# EAGLE design Switch-N-Sense (EAGLE 7.7.0)
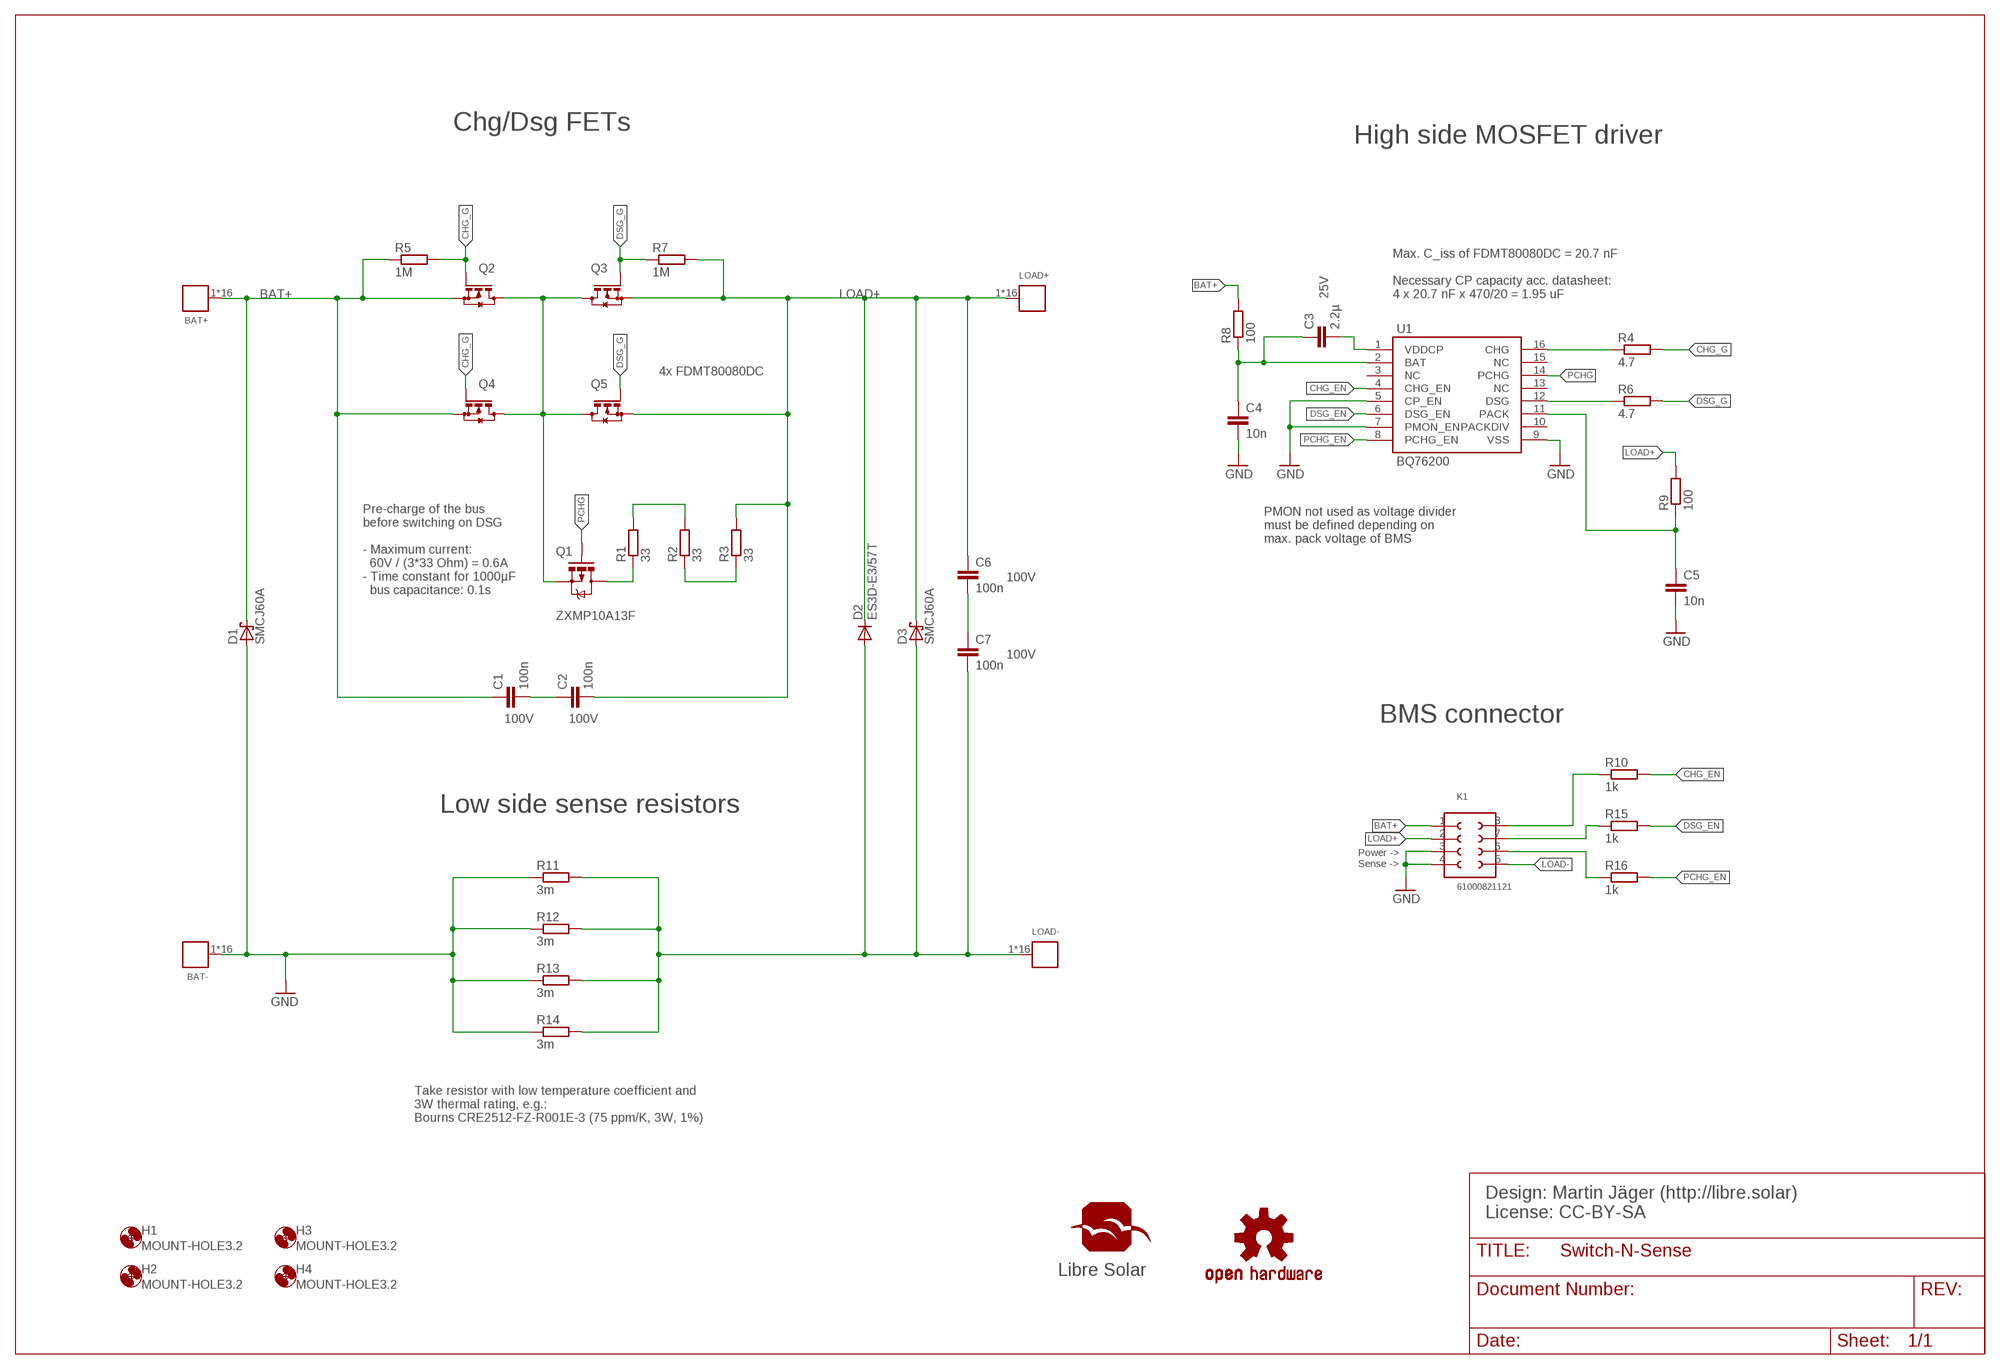
[diagram p0: schematic, sheet 1]

## Parts
BAT+  WP-BUCF_G  [16PINS_CIR]
BAT-  WP-BUCF_G  [16PINS_CIR]
C1  100n  C-EUC0603  [C0603]
C2  100n  C-EUC0603  [C0603]
C3  2.2µ  C-EUC0805  [C0805]
C4  10n  C-EUC0603  [C0603]
C5  10n  C-EUC0603  [C0603]
C6  100n  C-EUC0603  [C0603]
C7  100n  C-EUC0603  [C0603]
D1  SMCJ60A  SCHOTTKY-DIODESMC  [SMC]
D2  ES3D-E3/57T  DIODE-SMC  [SMC]
D3  SMCJ60A  SCHOTTKY-DIODESMC  [SMC]
H1  MOUNT-HOLE3.2  [3,2]
H2  MOUNT-HOLE3.2  [3,2]
H3  MOUNT-HOLE3.2  [3,2]
H4  MOUNT-HOLE3.2  [3,2]
K1  61000821121  [61000821121]
LOAD+  WP-BUCF_G  [16PINS_CIR]
LOAD-  WP-BUCF_G  [16PINS_CIR]
N1  OSHW-LOGOM  [OSHW-LOGO-M]
Q1  ZXMP10A13F  MOSFET-PCHANNEL  [SOT23-3]
Q2  FDMT80080DC  [FDMT80080DC]
Q3  FDMT80080DC  [FDMT80080DC]
Q4  FDMT80080DC  [FDMT80080DC]
Q5  FDMT80080DC  [FDMT80080DC]
R1  33  R-EU_R2010  [R2010]
R2  33  R-EU_R2010  [R2010]
R3  33  R-EU_R2010  [R2010]
R4  4.7  R-EU_R0603  [R0603]
R5  1M  R-EU_R0603  [R0603]
R6  4.7  R-EU_R0603  [R0603]
R7  1M  R-EU_R0603  [R0603]
R8  100  R-EU_R0603  [R0603]
R9  100  R-EU_R0603  [R0603]
R10  1k  R-EU_R0603  [R0603]
R11  3m  R-EU_R2512  [R2512]
R12  3m  R-EU_R2512  [R2512]
R13  3m  R-EU_R2512  [R2512]
R14  3m  R-EU_R2512  [R2512]
R15  1k  R-EU_R0603  [R0603]
R16  1k  R-EU_R0603  [R0603]
U1  BQ76200  [TSSOP16]
U$1  LIBRESOLAR_LOGO  [LIBRESOLAR_LOGO]

## Nets
BAT+: BAT+.1 BAT+.2 BAT+.3 BAT+.4 BAT+.5 BAT+.6 BAT+.7 BAT+.8 BAT+.9 BAT+.10 BAT+.11 BAT+.12 BAT+.13 BAT+.14 BAT+.15 BAT+.16 C1.1 D1.C K1.1 Q2.S Q4.S R5.1 R8.2
CHG: R4.1 U1.16(CHG)
CHG_EN: R10.2 U1.4(CHG_EN)
CHG_G: Q2.G Q4.G R4.2 R5.2
CHGDSG [power]: Q1.2(S) Q2.D Q3.D Q4.D Q5.D
DSG: R6.1 U1.12(DSG)
DSG_EN: R15.2 U1.6(DSG_EN)
DSG_G: Q3.G Q5.G R6.2 R7.1
GND [power]: BAT-.1 BAT-.2 BAT-.3 BAT-.4 BAT-.5 BAT-.6 BAT-.7 BAT-.8 BAT-.9 BAT-.10 BAT-.11 BAT-.12 BAT-.13 BAT-.14 BAT-.15 BAT-.16 C4.2 C5.2 D1.A K1.3 K1.4 R11.1 R12.1 R13.1 R14.1 U1.5(CP_EN) U1.7(PMON_EN) U1.9(VSS)
LOAD+ [power]: C2.2 C6.1 D2.C D3.C K1.2 LOAD+.1 LOAD+.2 LOAD+.3 LOAD+.4 LOAD+.5 LOAD+.6 LOAD+.7 LOAD+.8 LOAD+.9 LOAD+.10 LOAD+.11 LOAD+.12 LOAD+.13 LOAD+.14 LOAD+.15 LOAD+.16 Q3.S Q5.S R3.2 R7.2 R9.2
LOAD-: C7.2 D2.A D3.A K1.5 LOAD-.1 LOAD-.2 LOAD-.3 LOAD-.4 LOAD-.5 LOAD-.6 LOAD-.7 LOAD-.8 LOAD-.9 LOAD-.10 LOAD-.11 LOAD-.12 LOAD-.13 LOAD-.14 LOAD-.15 LOAD-.16 R11.2 R12.2 R13.2 R14.2
N$1: C6.2 C7.1
N$2: R1.2 R2.2
N$3: R2.1 R3.1
N$4: K1.7 R15.1
N$5: K1.6 R16.1
N$6: K1.8 R10.1
N$38: C3.2 U1.1(VDDCP)
N$40: C3.1 C4.1 R8.1 U1.2(BAT)
N$41: C5.1 R9.1 U1.11(PACK)
N$48: C1.2 C2.1
N$52: Q1.3(D) R1.1
PCHG: Q1.1(G) U1.14(PCHG)
PCHG_EN: R16.2 U1.8(PCHG_EN)
Unconnected: U1.3(NC) U1.10(PACKDIV) U1.13(NC) U1.15(NC)

## Notes on the sheet
- Chg/Dsg FETs
- High side MOSFET driver
- 25V
- Max. C_iss of FDMT80080DC = 20.7 nF
  
  Necessary CP capacity acc. datasheet:
  4 x 20.7 nF x 470/20 = 1.95 uF
- 4x FDMT80080DC
- PMON not used as voltage divider
  must be defined depending on
  max. pack voltage of BMS
- 100V
- Pre-charge of the bus
  before switching on DSG
  
  - Maximum current:
    60V / (3*33 Ohm) = 0.6A
  - Time constant for 1000µF
    bus capacitance: 0.1s
- 100V
- 100V | 100V | BMS connector
- Low side sense resistors
- Power ->
  Sense ->
- Take resistor with low temperature coefficient and 
  3W thermal rating, e.g.:
  Bourns CRE2512-FZ-R001E-3 (75 ppm/K, 3W, 1%)
- Design: Martin Jäger (http://libre.solar)
  License: CC-BY-SA

## Library data of the parts
BAT+ BAT- LOAD+ LOAD- = Wuerth_Elektronik_Power_Elements_rev15c:WP-BUCF: Bush with Pin-Plate Circumferences Characteristics Drill hole diameter:1.60(-0.03)mm Final hole diameter for HAL surface:1.45(+/-0.05)mm forchemical tin:1.475(+/-0.05)mm Min. layer thickness of copper in the via:25UM Max.layer thickness of tin in the via:15UM MATERIAL:CuZn39Pb3 Variant abbreviation CIR means Bush with Pin-Plate Circumferences F,G,H,E means Format Type HAL means Land pattern for HAL <http://katalog.we-online.de/media/images/v2/Family_WP-BUCF.jpg> Details see: http://katalog.we-online.de/en/em/Powerbuchsen_rundumlaufend/7461148?m 2015 (C) Wurth Elektronik
C1-C3 C6 C7 = rcl:C-EU: CAPACITOR, European symbol; MF: WALSIN; MPN: 0603B104K500CT; OC_FARNELL: 2496834
C4 C5 = rcl:C-EU: CAPACITOR, European symbol; MF: MURATA; MPN: GRM188R71H103KA01D.; OC_FARNELL: 8819980
D1 D3 = diode:SCHOTTKY-DIODE: Schottky Diode; MF: FAIRCHILD SEMICONDUCTOR; MPN: SMCJ75A; OC_FARNELL: 2322496
D2 = diode:DIODE-: DIODE; MF: VISHAY; MPN: ES3D-E3/57T.; OC_FARNELL: 1021753
H1-H4 = holes:MOUNT-HOLE: MOUNTING HOLE with drill center marker; OC_FARNELL: unknown
K1 = Board_to_Board_Connectors_rev15d:61000821121: WR-PHD 2.54mm Dual SMT Pin Header, 8 Pins =>Code : Con_BTB_PHD_2.54_2_61000821121 <http://katalog.we-online.de/media/images/eican/Con_BTB_PHD_2.54_2_6100xx21121_pf2.jpg> Details see: http://katalog.we-online.de/en/em/610_0xx_211_21 Created 2014-05-29, Karrer Zheng 2014 (C) Würth Elektronik
N1 = resolut:OSHW-LOGO: Open Source Hardware Logo This logo indicates the piece of hardware it is found on incorporates a OSHW license and/or adheres to the definition of open source hardware found here: http://freedomdefined.org/OSHW; OC_FARNELL: unknown
Q1 = SparkFun-DiscreteSemi:MOSFET-PCHANNEL: Generic PMOSFET IRLML2244 - TRANS-11153 (SOT-23 -20V -4.3A) (1.Gate 2.Source 3.Drain) FQP27P06 - COM-10349 <http://www.sparkfun.com/products/10349> (TO-220 -60V -27A) (1.Gate 2.Source 3.Drain); MF: DIODES INC.; MPN: ZXMP10A13FTA; OC_FARNELL: 1843777; PROD_ID: TRANS-08285
Q2-Q5 = resolut:FDMT80080DC; OC_FARNELL: unknown
R1-R3 = rcl:R-EU_: RESISTOR, European symbol; MF: WELWYN; MPN: ASC2010-33RFT4; OC_FARNELL: 2079038
R4-R7 R10 R15 R16 = rcl:R-EU_: RESISTOR, European symbol; MF: PANASONIC ELECTRONIC COMPONENTS; MPN: ERJU06F1004V; OC_FARNELL: 2145441
R8 R9 = rcl:R-EU_: RESISTOR, European symbol; MF: MULTICOMP; MPN: MCMR06X1001FTL; OC_FARNELL: 2073348
R11-R14 = rcl:R-EU_: RESISTOR, European symbol; OC_FARNELL: unknown
U1 = resolut:BQ76200; OC_FARNELL: unknown
U$1 = LibreSolar:LIBRESOLAR_LOGO

## Net classes
0 default: width 0.203 mm, drill 0.5 mm, clearance 0.152 mm
1 power: width 0.203 mm, drill 0.5 mm, clearance 0.152 mm
2 VIN: width 0.203 mm, drill 0.5 mm, clearance 0.152 mm

## Board
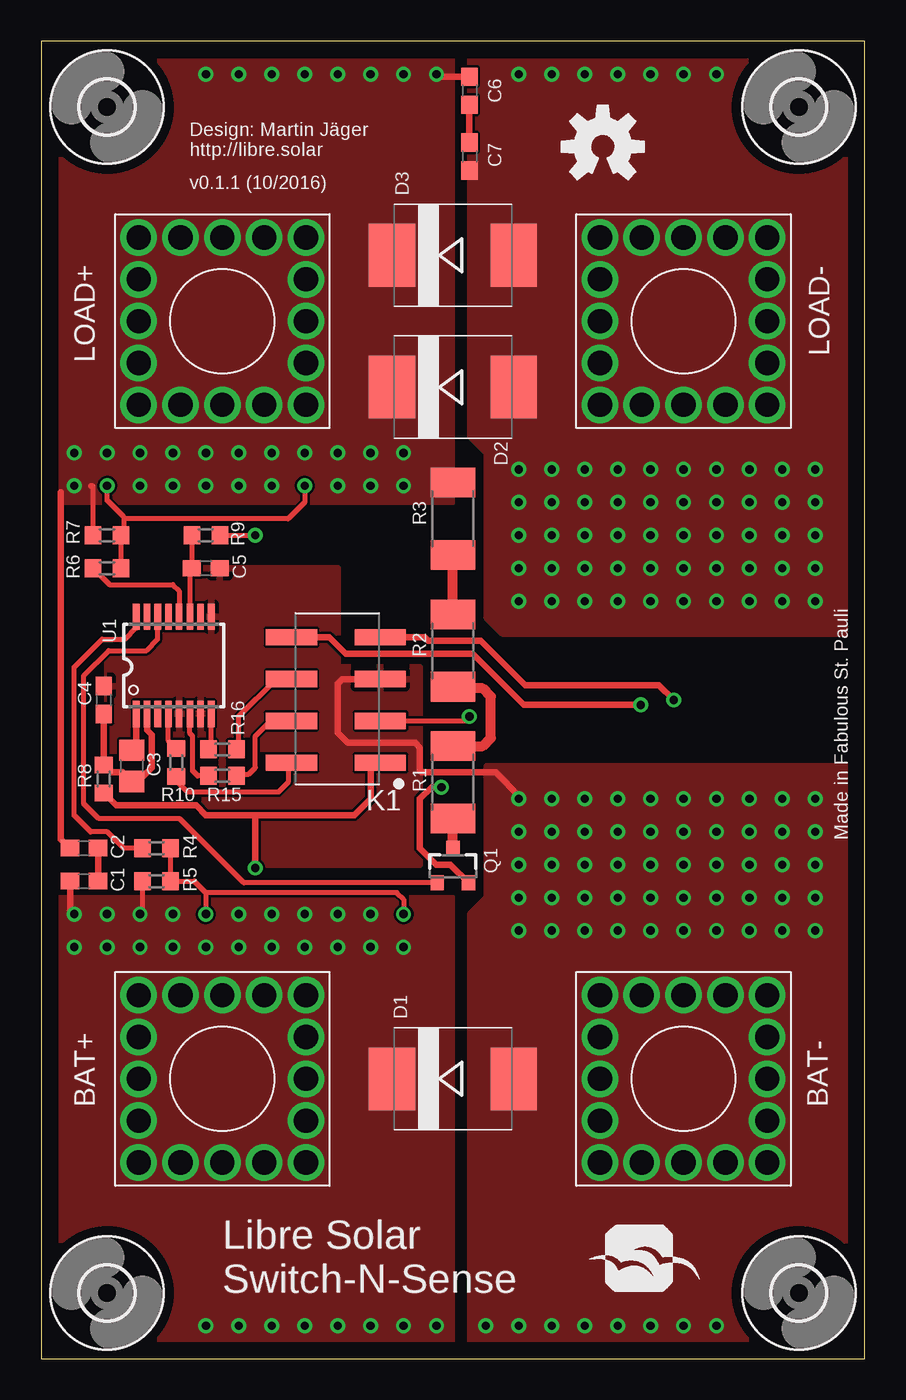
[diagram p1: board, top side]
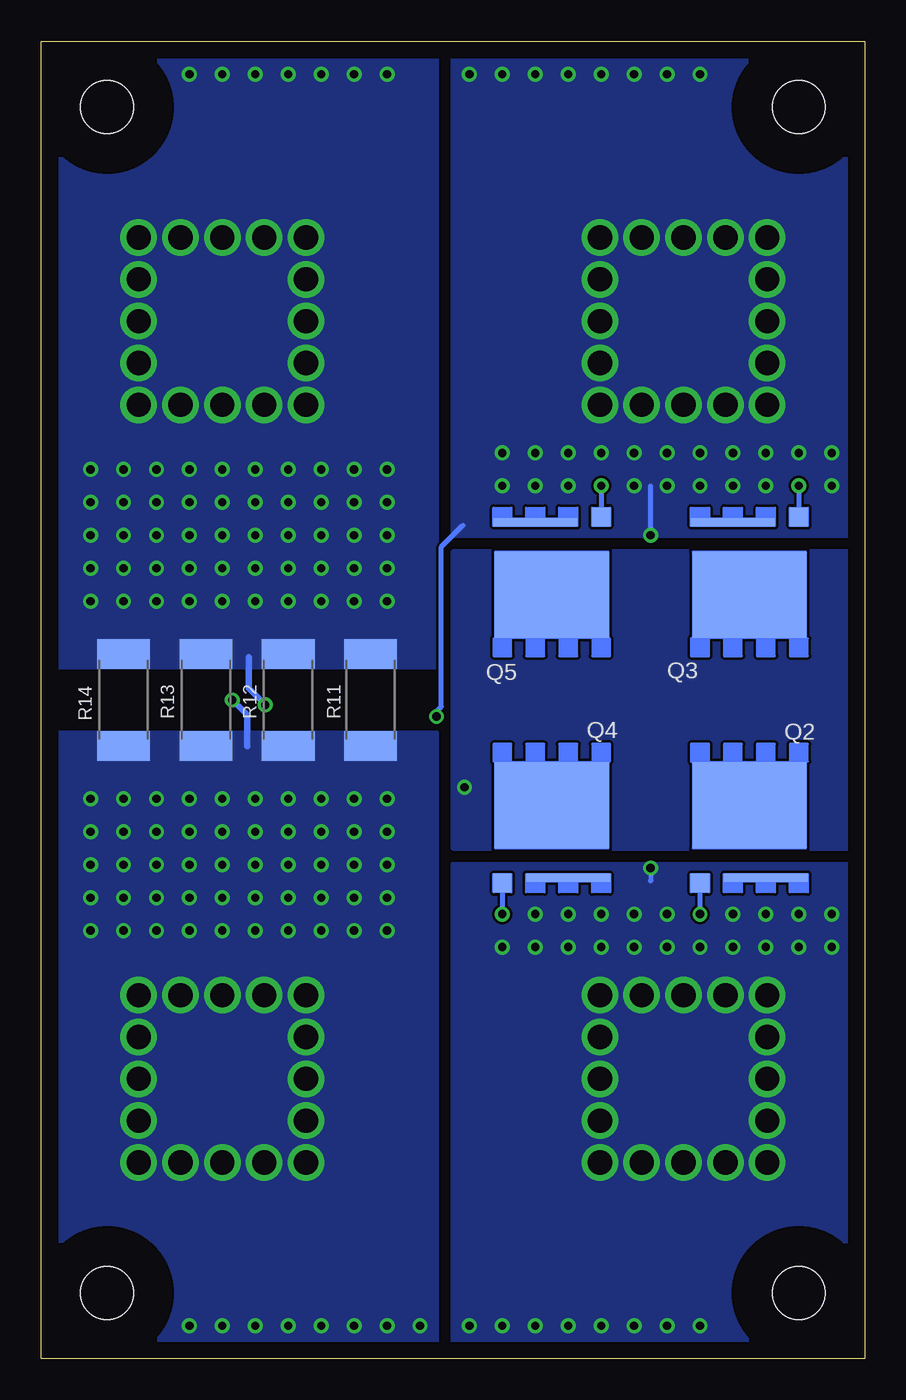
[diagram p2: board, bottom side, seen from below]

Size 50 x 80 mm. Coordinates in mm from the lower left corner, seen from the top.
Outline: 50,0 50,80 0,80 0,0 50,0
Copper layers (1*16): Top 0.035mm / dielectric 1.5mm / Bottom 0.035mm
Design rules "default *": minimum track width 6mil, minimum drill 0.3mm, track to track 6mil, track to pad 6mil, pad to pad 6mil, via to via 6mil, smd to smd 6mil, copper to edge 40mil, drill to drill 8mil, minimum pad ring 10mil, minimum via ring 8mil, stop-mask expansion 4mil, vias tented up to drill 0mil, thermal gap 10mil

### Footprints (pad centres in the part's own frame; a part is rotated, then mirrored left to right if it is on the bottom)
16PINS_CIR = drill 1.475: 1 -5.08,5.08; 2 -2.54,5.08; 3 0,5.08; 4 2.54,5.08; 5 5.08,5.08; 6 5.08,2.54; 7 5.08,0; 8 5.08,-2.54; 9 5.08,-5.08; 10 2.54,-5.08; 11 0,-5.08; 12 -2.54,-5.08; 13 -5.08,-5.08; 14 -5.08,-2.54; 15 -5.08,0; 16 -5.08,2.54
C0603 = smd 1.1 x 1: 1 -0.85,0; 2 0.85,0
C0805 = smd 1.3 x 1.5: 1 -0.95,0; 2 0.95,0
SMC = smd 2.8 x 3.8: A 3.7,0; C -3.7,0
3,2 = hole 3.2: 0,0
61000821121 = smd 1 x 3.1: 1 -6.35,-2.7; 2 -3.81,-2.7; 3 -1.27,-2.7; 4 1.27,-2.7; 5 1.27,2.7; 6 -1.27,2.7; 7 -3.81,2.7; 8 -6.35,2.7
SOT23-3 = smd 0.8 x 0.9: 1 -0.95,-1; 2 0.95,-1; 3 0,1.1
FDMT80080DC = smd 6.9 x 5.23: D 0,2.615 | smd 1.1 x 1.13: G -3,-2.115 | smd 5.1 x 0.48: S 1,-1.8
R2010 = smd 1.8 x 2.7: 1 -2.2,0; 2 2.2,0
R0603 = smd 1 x 1.1: 1 -0.85,0; 2 0.85,0
R2512 = smd 1.8 x 3.2: 1 -2.8,0; 2 2.8,0
TSSOP16 = smd 0.4 x 1.6: 1 -2.225,-2.85; 2 -1.575,-2.85; 3 -0.925,-2.85; 4 -0.275,-2.85; 5 0.375,-2.85; 6 1.025,-2.85; 7 1.675,-2.85; 8 2.325,-2.85; 9 2.325,3.05; 10 1.675,3.05; 11 1.025,3.05; 12 0.375,3.05; 13 -0.275,3.05; 14 -0.925,3.05; 15 -1.575,3.05; 16 -2.225,3.05

### Placement (x,y rotation side)
BAT+  11,17 90 top
BAT-  39,17 90 top
C1  2.6,29 0 top
C2  2.6,31 180 top
C3  5.5,36 90 top
C4  3.8,40 90 top
C5  10,48 0 top
C6  26,77 270 top
C7  26,73 270 top
D1  25,17 0 top
D2  25,59 0 top
D3  25,67 0 top
H1  4,4 90 top
H2  46,4 90 top
H3  4,76 90 top
H4  46,76 90 top
K1  17.9,42.54 90 top
LOAD+  11,63 90 top
LOAD-  39,63 90 top
N1  34.1,73.6 0 top
Q1  25,29.9 0 top
Q2  7,31 0 bottom
Q3  7,49 180 bottom
Q4  19,31 0 bottom
Q5  19,49 180 bottom
R1  25,35 90 top
R2  25,43 270 top
R3  25,51 90 top
R4  7,31 0 top
R5  7,29 0 top
R6  4,48 0 top
R7  4,50 180 top
R8  3.8,35.2 270 top
R9  10,50 0 top
R10  8.2,36.2 90 top
R11  30,40 90 bottom
R12  35,40 90 bottom
R13  40,40 90 bottom
R14  45,40 90 bottom
R15  11,35.4 180 top
R16  11,37 180 top
U1  8,42 0 top
U$1  34.3,4.1 0 top

### Tracks (layer width: path | path; a pad name or v marks a point on that pad's centre or on a via)
BAT+  (via drill 0.5)
  Top 0.305: R5.1 6.15,27
  Top 0.406: 13,33 v13,29.8 | 13,33 10,33 9.4,33.6 4.55,33.6 R8.2 | C1.1 1.75,27.25 v2,27 | 13,33 19,33 20,34 20,36 20.41,36 K1.1
  Bottom 0.305: v13,29.8 13,29
  other vias: 24,2 22,2 20,2 18,2 16,2 12,2 10,2 14,2 4,27 6,27 8,27 20,27 18,27 16,27 14,27 12,27 2,25 4,25 6,25 8,25 10,25 12,25 14,25 16,25 18,25 20,25 22,25
  pour Bottom (no thermals): 1,1 1,30 25,30 25,1
  pour Top (no thermals): 1,1 25,1 25,28 1,28
CHG
  Top 0.305: R4.1 5,31 4,32 3,32 2,33 2,42 3.7,43.7 5.1,43.7 5.78,44.38 U1.16
CHG_EN
  Top 0.305: R10.2 7.72,37.52 U1.4
CHG_G  (via drill 0.5)
  Top 0.305: R4.2 R5.2 9.3,29 10,28.3 | 10,28.3 v10,27 | 10,28.3 21.6,28.3 22,27.9 v22,27
  Bottom 0.305: Q2.G v10,27 | v22,27 Q4.G 21.89,29
CHGDSG  (via drill 0.5)
  Top 0.406: Q1.2 24.85,30 24,30 23,31 23,34 23.7,34.7 v24.3,34.7
  pour Bottom (no thermals): 1,31 1,49 25,49 25,31
DSG
  Top 0.305: R6.1 4.15,47 8,47 8.38,46.62 U1.12
DSG_EN
  Top 0.305: R15.2 9.5,35.4 9.2,35.7 9.2,37.8 9.03,37.98 U1.6
DSG_G  (via drill 0.5)
  Top 0.305: v16,53 16,52 15,51 5.12,51 5,51.12 | R6.2 R7.1 5,50.15 5,51.12 | 5,51.12 4,52.12 v4,53
  Bottom 0.305: v4,53 Q3.G | v16,53 Q5.G
GND  (via drill 0.5)
  Top 0.305: 20.7,43.91 K1.4
  Top 0.406: K1.4 23.29,43.81 23.5,43.6 26.7,43.6 29.4,40.9 37.5,40.9 v38.4,40 | K1.3 18.27,41.27 18,41 18,38 18.6,37.4 22.7,37.4 23,37.1 23,35.7 23.1,35.6 27.6,35.6 29,34.2 v29,34
  Bottom 0.406: v38.4,40 37.5,39.1 37.5,37.2
  other vias: 27,2 29,2 31,2 33,2 35,2 37,2 39,2 41,2 29,26 29,28 29,30 29,32 31,34 31,32 31,30 31,28 33,28 35,28 35,30 33,30 33,32 35,32 37,32 37,30 37,28 37,34 35,34 33,34 39,34 39,32 39,30 39,28 41,28 41,30 41,32 41,34 43,34 43,32 43,30 43,28 45,28 45,30 45,32 45,34 47,34 47,32 47,30 47,28 47,26 31,26 33,26 35,26 37,26 39,26 41,26 43,26 45,26
  pour Top: 4,30 4,48 18,48 18,42 23,42 23,30
  pour Bottom (no thermals): 26,1 49,1 49,38 26,38
  pour Top (no thermals): 26,1 49,1 49,36 27,36 27,28 26,27
LOAD+  (via drill 0.5)
  Top 0.305: R7.2 3.15,53 3,53 | R9.2 v13,50 | K1.2 25.73,38.73 v26,39
  Top 0.406: 1.2,52.6 1.2,31.55 C2.2 | C6.1 24.15,77.85 v24,78
  Bottom 0.305: v13,50 13,53 | v26,39 26,39.3 25.7,39.6 25.7,49.3 24.4,50.6
  other vias: 22,78 20,78 18,78 16,78 14,78 12,78 10,78 2,55 6,55 8,55 10,55 12,55 14,55 18,55 20,53 22,53 6,53 14,53 12,53 10,53 8,53 4,55 16,55 20,55 22,55 18,53 2,53
  pour Bottom (no thermals): 1,50 1,79 25,79 25,50
  pour Top (no thermals): 1,79 1,52 25,52 25,79
LOAD-  (via drill 0.5)
  Top 0.305: 15.3,43.91 K1.5
  Top 0.406: K1.5 17.49,43.81 18.5,42.8 26.2,42.8 29.3,39.7 v36.4,39.7
  Bottom 0.406: v36.4,39.7 37.4,40.7 37.4,42.6
  other vias: 29,46 31,46 33,46 35,46 37,46 39,46 41,46 43,46 45,46 47,46 29,48 31,48 33,48 35,48 37,48 39,48 41,48 43,48 45,48 47,48 29,50 31,50 33,50 35,50 37,50 39,50 41,50 43,50 45,50 47,50 29,52 31,52 33,52 35,52 37,52 39,52 41,52 43,52 45,52 47,52 29,54 31,54 33,54 35,54 37,54 39,54 41,54 43,54 45,54 47,54 29,78 31,78 33,78 35,78 37,78 39,78 41,78
  pour Bottom (no thermals): 49,42 49,79 26,79 26,42
  pour Top (no thermals): 49,44 49,79 26,79 26,56 27,55 27,45 28,44
N$1
  Top 0.406: C6.2 C7.1
N$2
  Top 0.61: R1.2 26.8,37.2 27.3,37.7 27.3,40.2 26.8,40.7 25.1,40.7 R2.2
N$3
  Top 0.61: R2.1 R3.1
N$4
  Top 0.305: R15.1 11.95,35.5 12.6,35.5 13,35.9 13,37.8 13.93,38.73 K1.7
N$5
  Top 0.305: R16.1 12,37.15 12,39 14.27,41.27 K1.6
N$6
  Top 0.305: K1.8 15,35.99 15,35 14.4,34.4 8.9,34.4 8.2,35.1 R10.1
N$38
  Top 0.406: U1.1 5.78,37.33 C3.2
N$40
  Top 0.406: C4.1 R8.1 3.85,36.05 4.3,35.6 4.95,35.6 C3.1 5.55,35.1 6,35.2 6.7,35.9 6.7,37.9 6.42,38.17 U1.2
N$41
  Top 0.305: U1.11 9.03,47.88 C5.1 R9.1
N$48
  Top 0.406: C1.2 C2.1
N$52
  Top 0.61: Q1.3 R1.1
PCHG
  Top 0.305: Q1.1 12.3,28.9 8.4,32.8 3.5,32.8 2.6,33.7 2.6,41.5 4.1,43 6.4,43 7.08,43.67 U1.14
PCHG_EN
  Top 0.305: R16.2 10.32,37.17 U1.8

### Text on the board
tPlace: Design: Martin Jäger / http://libre.solar | v0.1.1 (10/2016) | Made in Fabulous St. Pauli | Libre Solar / Switch-N-Sense